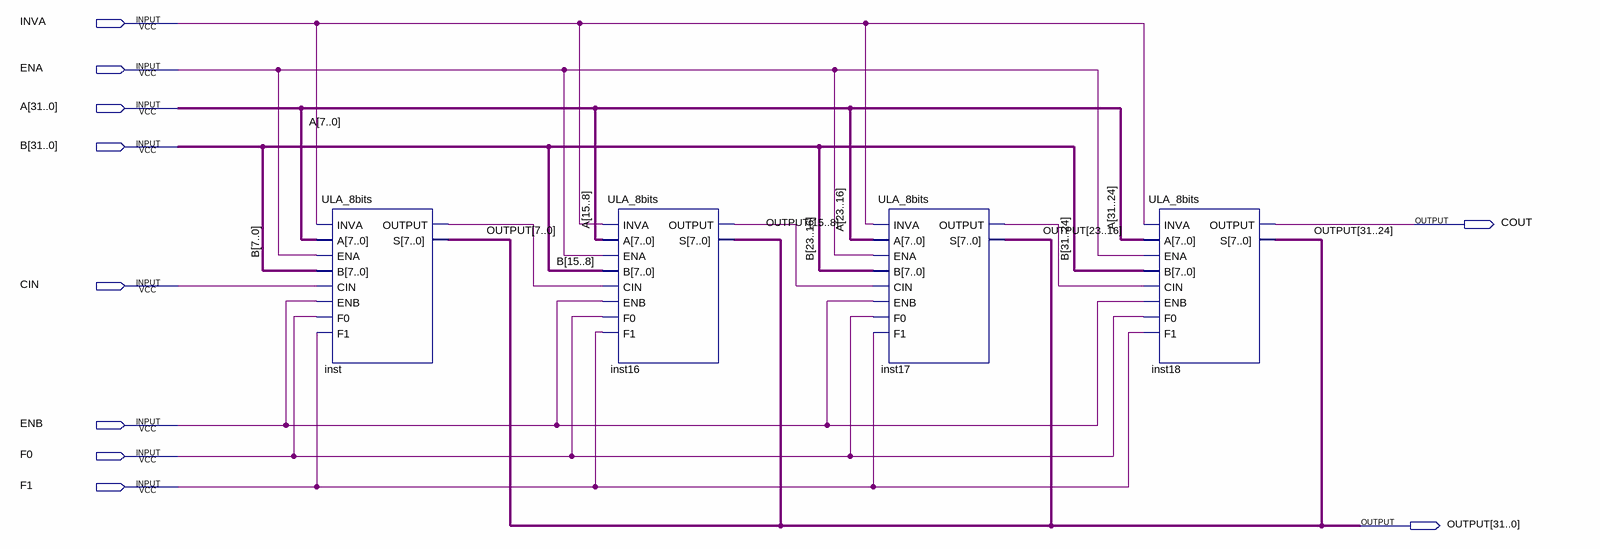
[diagram p0: schematic sheet]
// Quartus schematic ULA_32bits.bdf as structural Verilog: 4 symbols, 10 pins
module ULA_32bits (
  input  INVA,
  input  ENA,
  input  [31:0] A,
  input  [31:0] B,
  input  CIN,
  input  ENB,
  input  F0,
  input  F1,
  output COUT,
  output [31:0] OUTPUT
);

  wire inst16_output, inst17_output, inst_output;

  ULA_8bits inst (
    .INVA(INVA), .A(A[7:0]), .ENA(ENA), .B(B[7:0]), .CIN(CIN), .ENB(ENB), .F0(F0), .F1(F1),
    .OUTPUT(inst_output), .S(OUTPUT[7:0]));
  ULA_8bits inst16 (
    .INVA(INVA), .A(A[15:8]), .ENA(ENA), .B(B[15:8]), .CIN(inst_output), .ENB(ENB), .F0(F0), .F1(F1),
    .OUTPUT(inst16_output), .S(OUTPUT[15:8]));
  ULA_8bits inst17 (
    .INVA(INVA), .A(A[23:16]), .ENA(ENA), .B(B[23:16]), .CIN(inst16_output), .ENB(ENB), .F0(F0), .F1(F1),
    .OUTPUT(inst17_output), .S(OUTPUT[23:16]));
  ULA_8bits inst18 (
    .INVA(INVA), .A(A[31:24]), .ENA(ENA), .B(B[31:24]), .CIN(inst17_output), .ENB(ENB), .F0(F0), .F1(F1),
    .OUTPUT(COUT), .S(OUTPUT[31:24]));
endmodule
